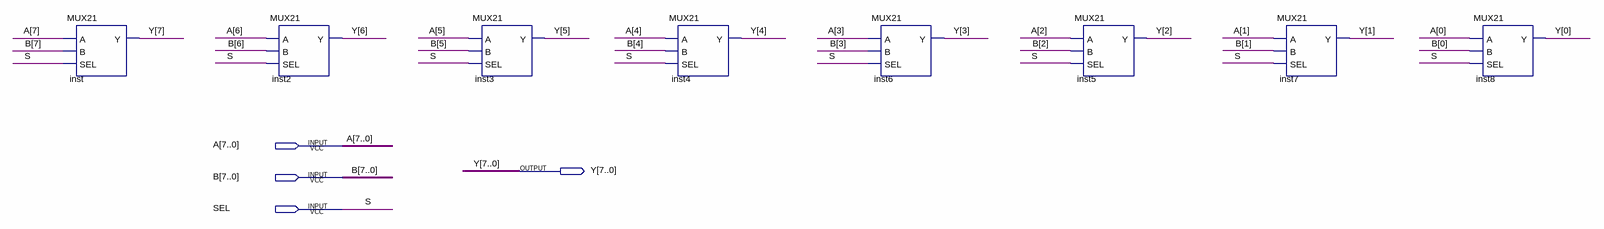
[diagram p0: schematic sheet]
// Quartus schematic MUX21_8BIT.bdf as structural Verilog: 8 symbols, 4 pins
module MUX21_8BIT (
  input  [7:0] A,
  input  [7:0] B,
  input  SEL,
  output [7:0] Y
);

  MUX21 inst (.A(A[7]), .B(B[7]), .SEL(SEL), .Y(Y[7]));
  MUX21 inst2 (.A(A[6]), .B(B[6]), .SEL(SEL), .Y(Y[6]));
  MUX21 inst3 (.A(A[5]), .B(B[5]), .SEL(SEL), .Y(Y[5]));
  MUX21 inst4 (.A(A[4]), .B(B[4]), .SEL(SEL), .Y(Y[4]));
  MUX21 inst6 (.A(A[3]), .B(B[3]), .SEL(SEL), .Y(Y[3]));
  MUX21 inst5 (.A(A[2]), .B(B[2]), .SEL(SEL), .Y(Y[2]));
  MUX21 inst7 (.A(A[1]), .B(B[1]), .SEL(SEL), .Y(Y[1]));
  MUX21 inst8 (.A(A[0]), .B(B[0]), .SEL(SEL), .Y(Y[0]));

  // Other names for the same wires on the sheet: S = SEL
endmodule
